# Altium schematic sheet Batt_Op_Amp.SchDoc
size C
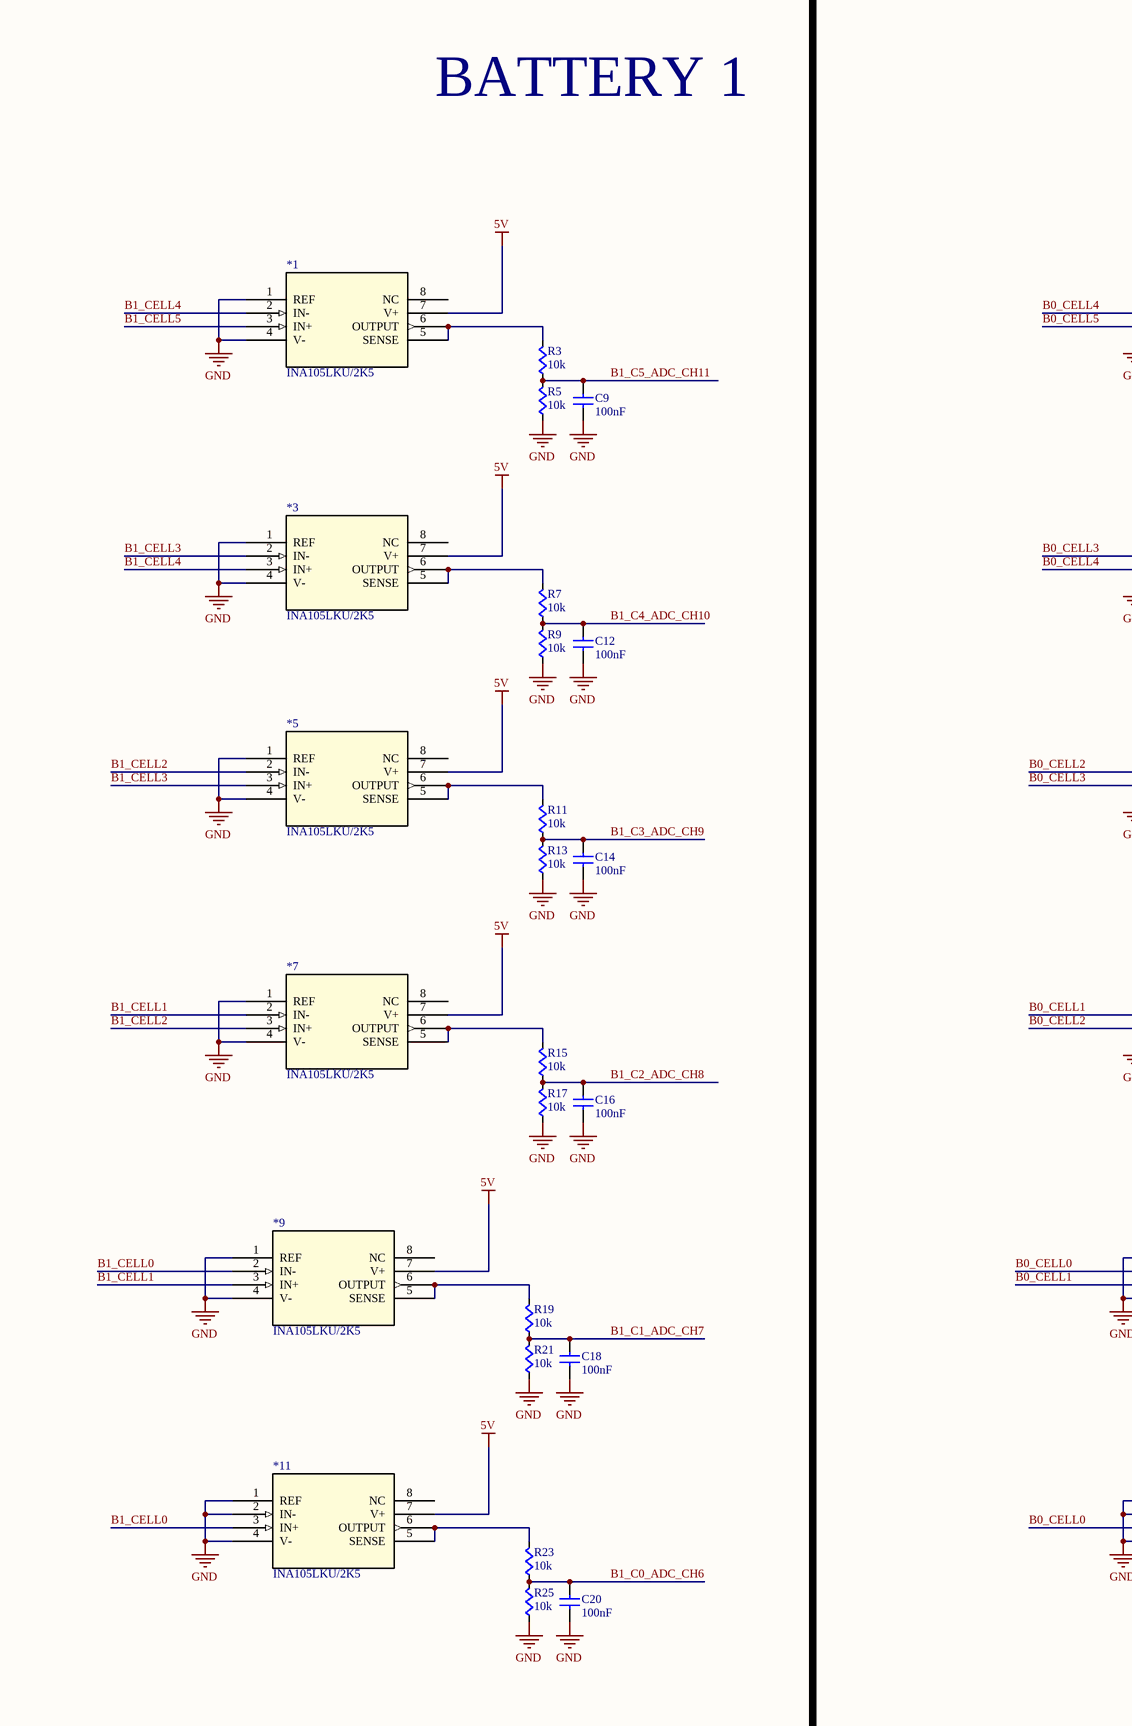
[diagram p0: Batt_Op_Amp.SchDoc, left]
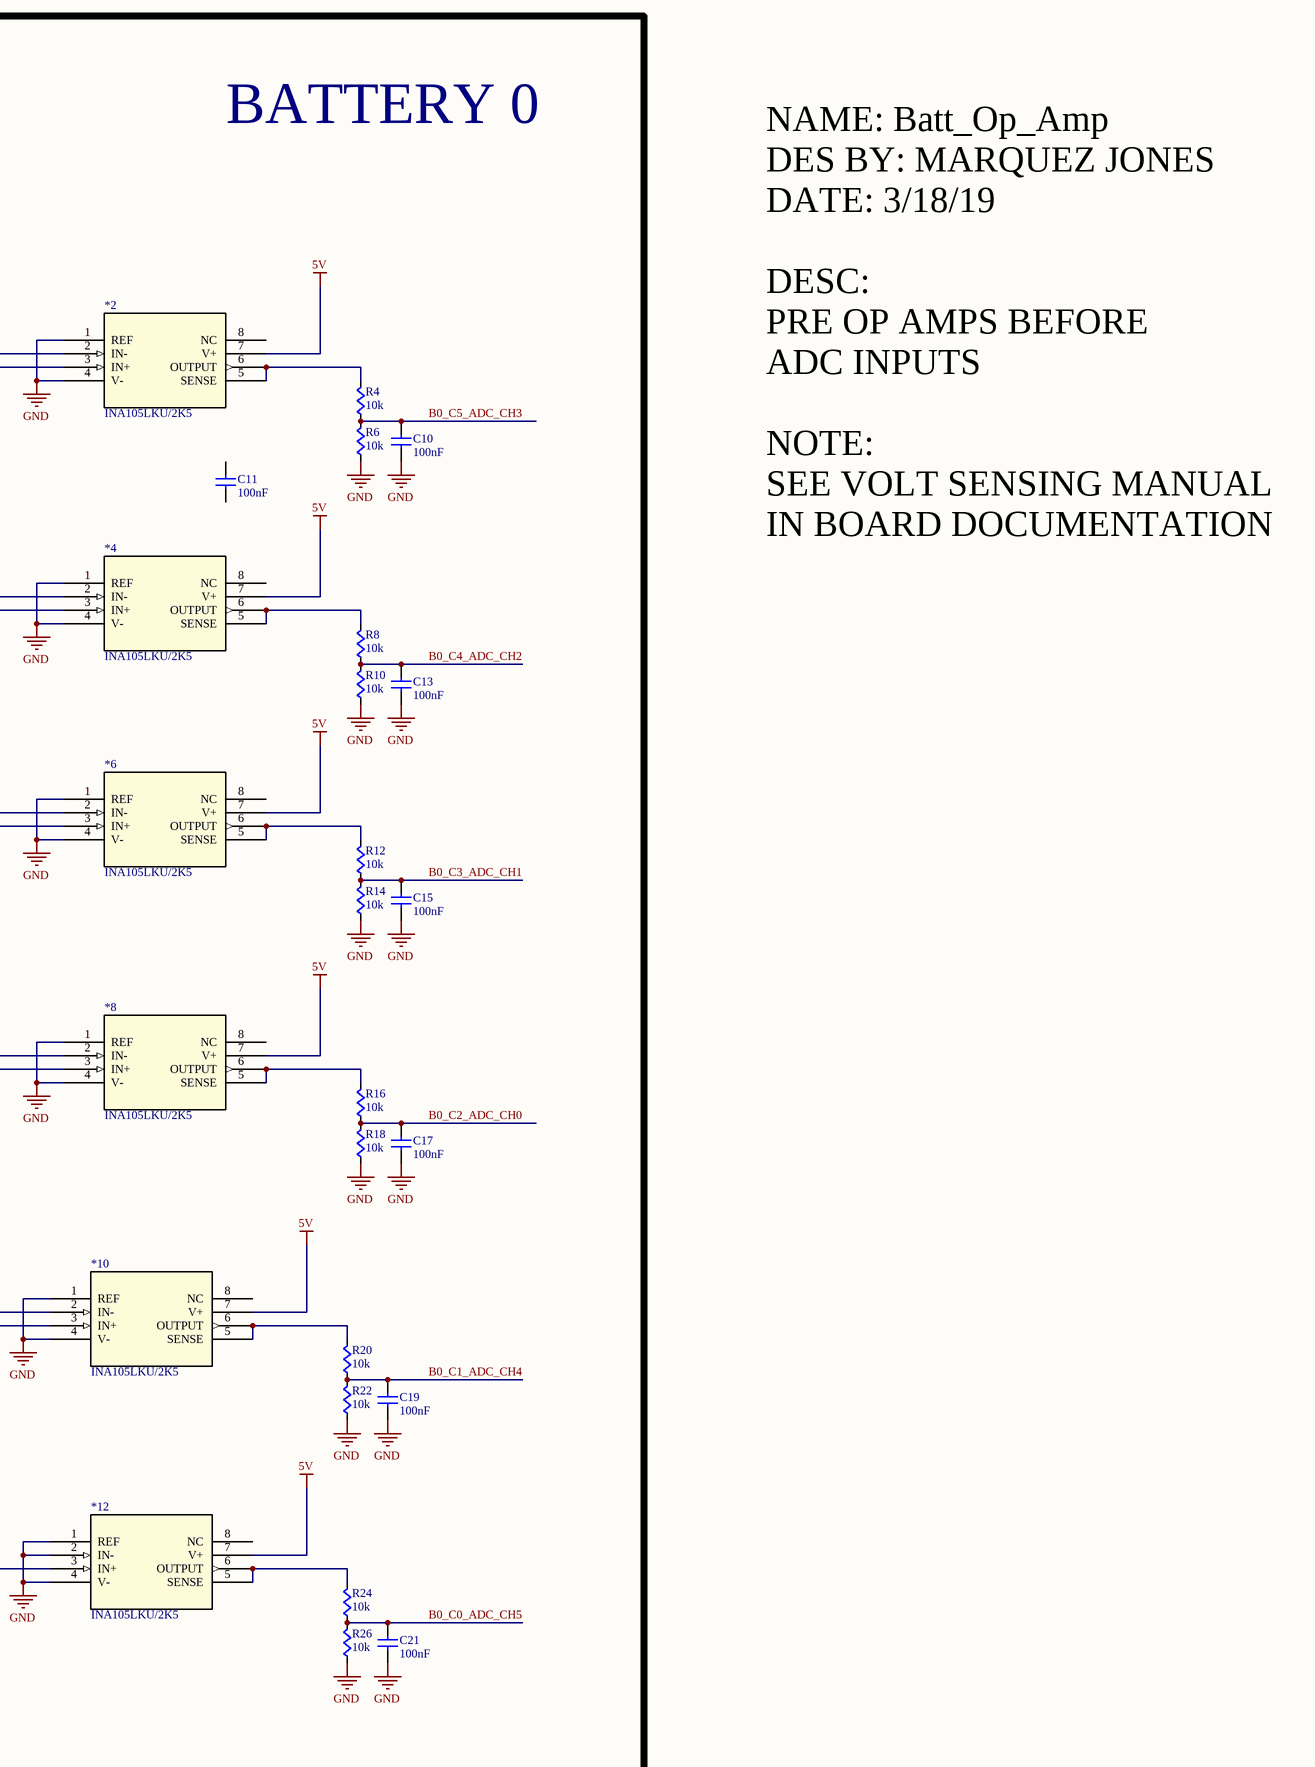
[diagram p1: Batt_Op_Amp.SchDoc, right]

## Parts
*1  INA105LKU/2K5  [SOIC-8N]
*2  INA105LKU/2K5  [SOIC-8N]
*3  INA105LKU/2K5  [SOIC-8N]
*4  INA105LKU/2K5  [SOIC-8N]
*5  INA105LKU/2K5  [SOIC-8N]
*6  INA105LKU/2K5  [SOIC-8N]
*7  INA105LKU/2K5  [SOIC-8N]
*8  INA105LKU/2K5  [SOIC-8N]
*9  INA105LKU/2K5  [SOIC-8N]
*10  INA105LKU/2K5  [SOIC-8N]
*11  INA105LKU/2K5  [SOIC-8N]
*12  INA105LKU/2K5  [SOIC-8N]
C9  value 100nF  [CAPC0603]  (hidden comment: Cap)
C10  value 100nF  [CAPC0603]  (hidden comment: Cap)
C11  value 100nF  [CAPC0603]  (hidden comment: Cap)
C12  value 100nF  [CAPC0603]  (hidden comment: Cap)
C13  value 100nF  [CAPC0603]  (hidden comment: Cap)
C14  value 100nF  [CAPC0603]  (hidden comment: Cap)
C15  value 100nF  [CAPC0603]  (hidden comment: Cap)
C16  value 100nF  [CAPC0603]  (hidden comment: Cap)
C17  value 100nF  [CAPC0603]  (hidden comment: Cap)
C18  value 100nF  [CAPC0603]  (hidden comment: Cap)
C19  value 100nF  [CAPC0603]  (hidden comment: Cap)
C20  value 100nF  [CAPC0603]  (hidden comment: Cap)
C21  value 100nF  [CAPC0603]  (hidden comment: Cap)
R3  value 10k  [WSLP5931]  (hidden comment: Res)
R4  value 10k  [WSLP5931]  (hidden comment: Res)
R5  value 10k  [WSLP5931]  (hidden comment: Res)
R6  value 10k  [WSLP5931]  (hidden comment: Res)
R7  value 10k  [WSLP5931]  (hidden comment: Res)
R8  value 10k  [WSLP5931]  (hidden comment: Res)
R9  value 10k  [WSLP5931]  (hidden comment: Res)
R10  value 10k  [WSLP5931]  (hidden comment: Res)
R11  value 10k  [WSLP5931]  (hidden comment: Res)
R12  value 10k  [WSLP5931]  (hidden comment: Res)
R13  value 10k  [WSLP5931]  (hidden comment: Res)
R14  value 10k  [WSLP5931]  (hidden comment: Res)
R15  value 10k  [WSLP5931]  (hidden comment: Res)
R16  value 10k  [WSLP5931]  (hidden comment: Res)
R17  value 10k  [WSLP5931]  (hidden comment: Res)
R18  value 10k  [WSLP5931]  (hidden comment: Res)
R19  value 10k  [WSLP5931]  (hidden comment: Res)
R20  value 10k  [WSLP5931]  (hidden comment: Res)
R21  value 10k  [WSLP5931]  (hidden comment: Res)
R22  value 10k  [WSLP5931]  (hidden comment: Res)
R23  value 10k  [WSLP5931]  (hidden comment: Res)
R24  value 10k  [WSLP5931]  (hidden comment: Res)
R25  value 10k  [WSLP5931]  (hidden comment: Res)
R26  value 10k  [WSLP5931]  (hidden comment: Res)

## Blocks framed on the sheet
BATTERY 1: *1 *3 *5 *7 *9 *11 C9 C12 C14 C16 C18 C20 R3 R5 R7 R9 R11 R13 R15 R17 R19 R21 R23 R25
BATTERY 0: *2 *4 *6 *8 *10 *12 C10 C11 C13 C15 C17 C19 C21 R4 R6 R8 R10 R12 R14 R16 R18 R20 R22 R24 R26

## Nets
5V: *1.7(V+) *2.7(V+) *3.7(V+) *4.7(V+) *5.7(V+) *6.7(V+) *7.7(V+) *8.7(V+) *9.7(V+) *10.7(V+) *11.7(V+) *12.7(V+)
GND: *1.1(REF) *1.4(V-) *2.1(REF) *2.4(V-) *3.1(REF) *3.4(V-) *4.1(REF) *4.4(V-) *5.1(REF) *5.4(V-) *6.1(REF) *6.4(V-) *7.1(REF) *7.4(V-) *8.1(REF) *8.4(V-) *9.1(REF) *9.4(V-) *10.1(REF) *10.4(V-) *11.1(REF) *11.2(IN-) *11.4(V-) *12.1(REF) *12.2(IN-) *12.4(V-) C9.2(B) C10.2(B) C12.2(B) C13.2(B) C14.2(B) C15.2(B) C16.2(B) C17.2(B) C18.2(B) C19.2(B) C20.2(B) C21.2(B) R5.2(B) R6.2(B) R9.2(B) R10.2(B) R13.2(B) R14.2(B) R17.2(B) R18.2(B) R21.2(B) R22.2(B) R25.2(B) R26.2(B)
B0_C0_ADC_CH5: C21.1(A) R24.2(B) R26.1(A)
B0_C1_ADC_CH4: C19.1(A) R20.2(B) R22.1(A)
B0_C2_ADC_CH0: C17.1(A) R16.2(B) R18.1(A)
B0_C3_ADC_CH1: C15.1(A) R12.2(B) R14.1(A)
B0_C4_ADC_CH2: C13.1(A) R8.2(B) R10.1(A)
B0_C5_ADC_CH3: C10.1(A) R4.2(B) R6.1(A)
B0_CELL0: *10.2(IN-) *12.3(IN+)
B0_CELL1: *8.2(IN-) *10.3(IN+)
B0_CELL2: *6.2(IN-) *8.3(IN+)
B0_CELL3: *4.2(IN-) *6.3(IN+)
B0_CELL4: *2.2(IN-) *4.3(IN+)
B0_CELL5: *2.3(IN+)
B1_C0_ADC_CH6: C20.1(A) R23.2(B) R25.1(A)
B1_C1_ADC_CH7: C18.1(A) R19.2(B) R21.1(A)
B1_C2_ADC_CH8: C16.1(A) R15.2(B) R17.1(A)
B1_C3_ADC_CH9: C14.1(A) R11.2(B) R13.1(A)
B1_C4_ADC_CH10: C12.1(A) R7.2(B) R9.1(A)
B1_C5_ADC_CH11: C9.1(A) R3.2(B) R5.1(A)
B1_CELL0: *9.2(IN-) *11.3(IN+)
B1_CELL1: *7.2(IN-) *9.3(IN+)
B1_CELL2: *5.2(IN-) *7.3(IN+)
B1_CELL3: *3.2(IN-) *5.3(IN+)
B1_CELL4: *1.2(IN-) *3.3(IN+)
B1_CELL5: *1.3(IN+)
Net*1_5: *1.5(SENSE) *1.6(OUTPUT) R3.1(A)
Net*2_5: *2.5(SENSE) *2.6(OUTPUT) R4.1(A)
Net*3_5: *3.5(SENSE) *3.6(OUTPUT) R7.1(A)
Net*4_5: *4.5(SENSE) *4.6(OUTPUT) R8.1(A)
Net*5_5: *5.5(SENSE) *5.6(OUTPUT) R11.1(A)
Net*6_5: *6.5(SENSE) *6.6(OUTPUT) R12.1(A)
Net*7_5: *7.5(SENSE) *7.6(OUTPUT) R15.1(A)
Net*8_5: *8.5(SENSE) *8.6(OUTPUT) R16.1(A)
Net*9_5: *9.5(SENSE) *9.6(OUTPUT) R19.1(A)
Net*10_5: *10.5(SENSE) *10.6(OUTPUT) R20.1(A)
Net*11_5: *11.5(SENSE) *11.6(OUTPUT) R23.1(A)
Net*12_5: *12.5(SENSE) *12.6(OUTPUT) R24.1(A)

Not connected (* = marked no-connect by the designer): *1 8(NC); *2 8(NC); *3 8(NC); *4 8(NC); *5 8(NC); *6 8(NC); *7 8(NC); *8 8(NC); *9 8(NC); *10 8(NC); *11 8(NC); *12 8(NC); C11 1(A) 2(B)

## Notes on the sheet
- NAME: Batt_Op_Amp
  DES BY: MARQUEZ JONES
  DATE: 3/18/19
  DESC:
  PRE OP AMPS BEFORE
  ADC INPUTS
  NOTE:
  SEE VOLT SENSING MANUAL
  IN BOARD DOCUMENTATION

## Library data of the parts
C9-C21 = Cap: Supplier 1: Digi-Key; Supplier Part Number 1: 1276-1000-1-ND
R3-R26 = Res: Supplier 1: Digi-Key; Supplier Part Number 1: RMCF0603JT10K0CT-ND